# EAGLE design 1x16 to 1x16 (EAGLE 6.4)
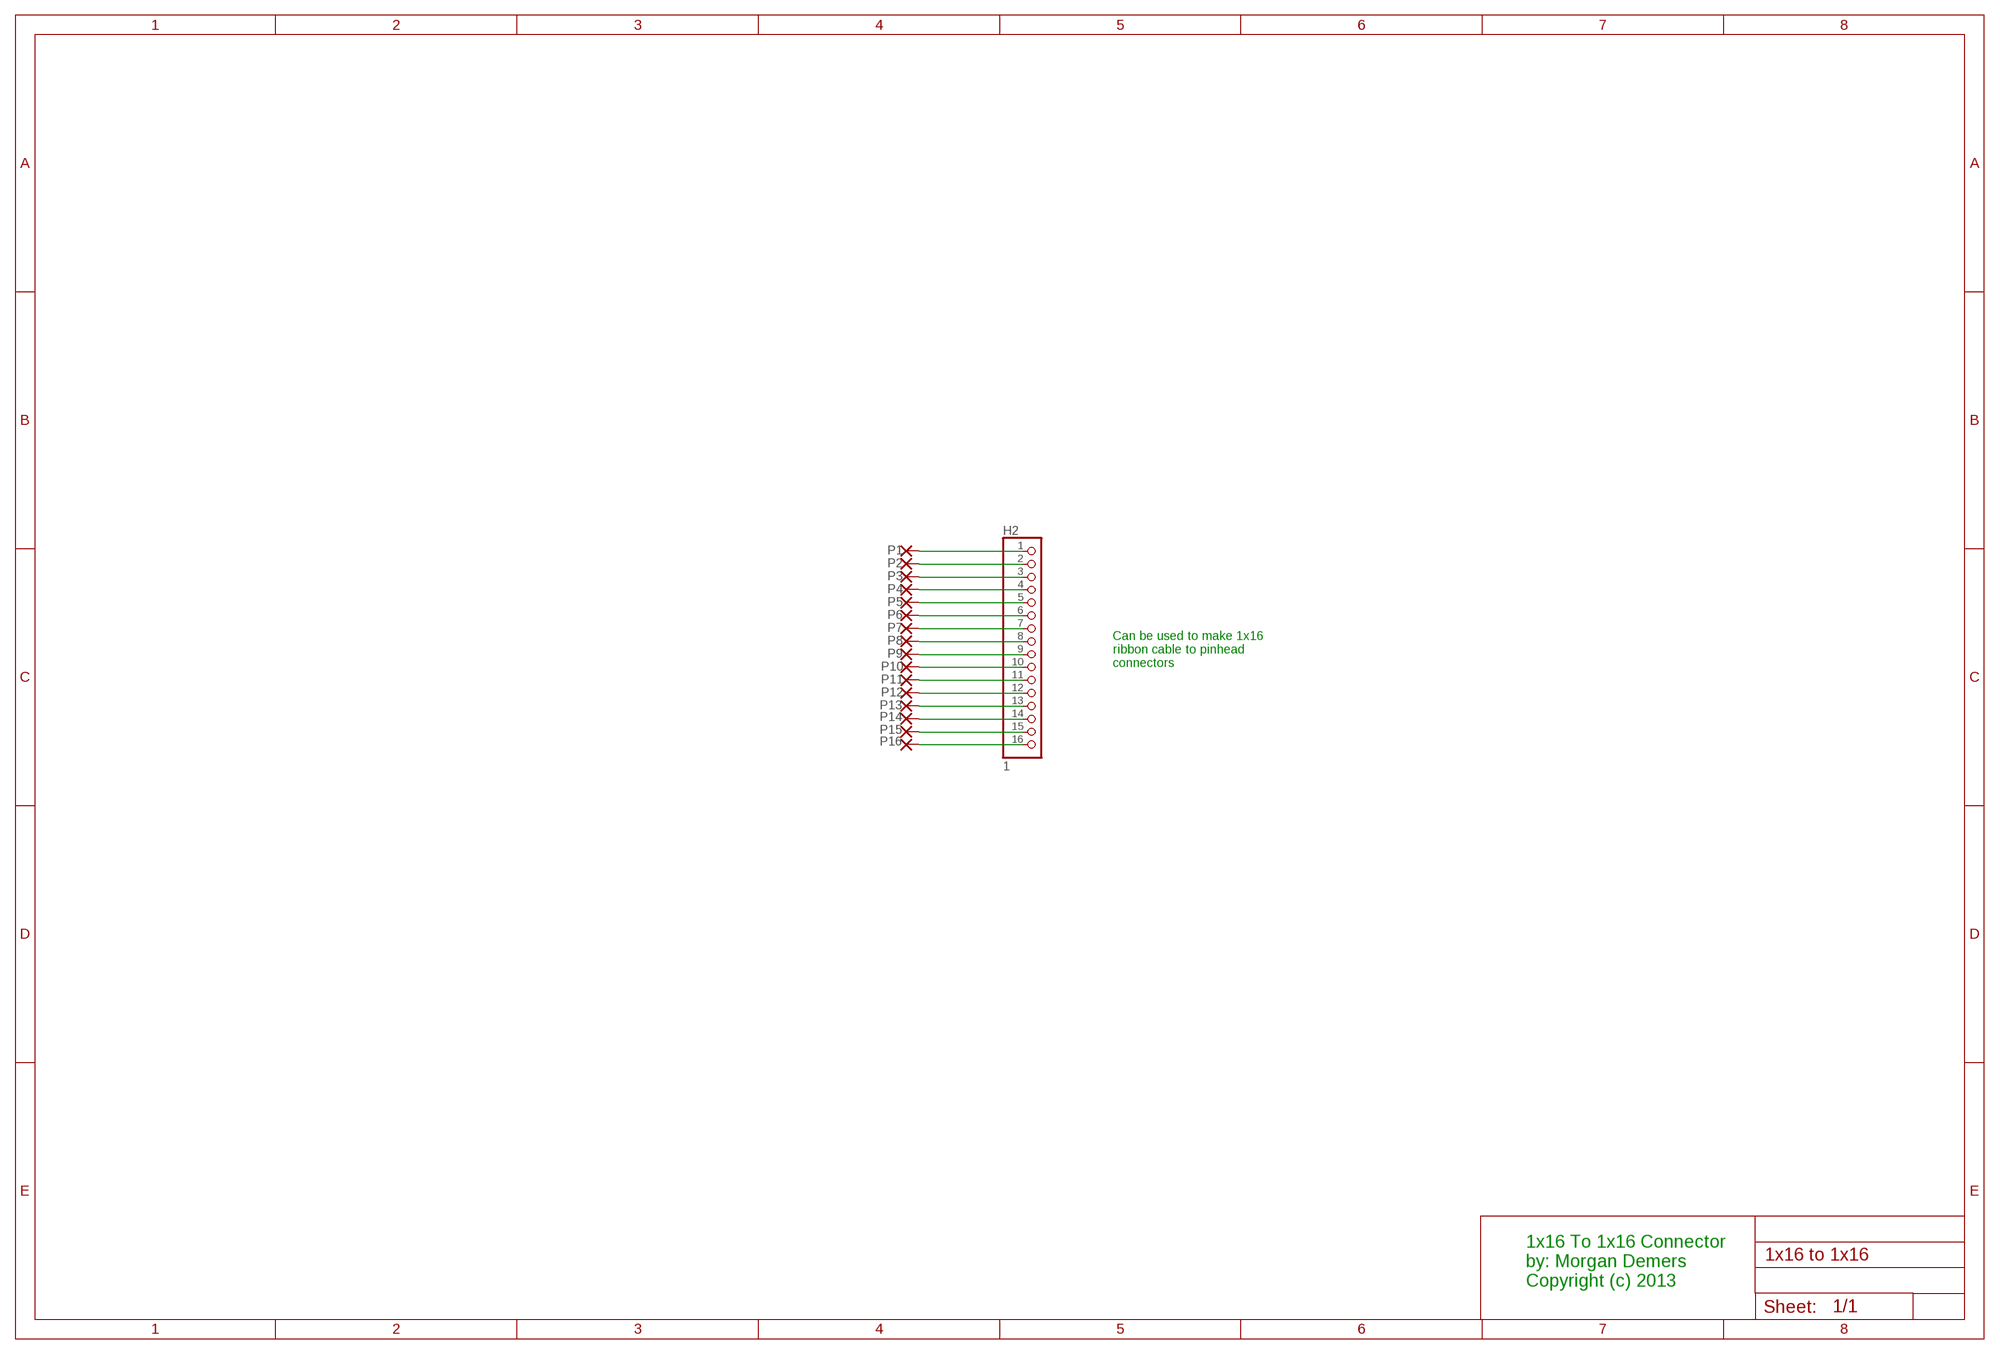
[diagram p0: schematic, sheet 1]

## Parts
H2  1  PINHD-1X16  [1X16]
P1  1,6/0,9  [1,6/0,9]
P2  1,6/0,9  [1,6/0,9]
P3  1,6/0,9  [1,6/0,9]
P4  1,6/0,9  [1,6/0,9]
P5  1,6/0,9  [1,6/0,9]
P6  1,6/0,9  [1,6/0,9]
P7  1,6/0,9  [1,6/0,9]
P8  1,6/0,9  [1,6/0,9]
P9  1,6/0,9  [1,6/0,9]
P10  1,6/0,9  [1,6/0,9]
P11  1,6/0,9  [1,6/0,9]
P12  1,6/0,9  [1,6/0,9]
P13  1,6/0,9  [1,6/0,9]
P14  1,6/0,9  [1,6/0,9]
P15  1,6/0,9  [1,6/0,9]
P16  1,6/0,9  [1,6/0,9]

## Nets
S$1: H2.1 P1.1(P)
S$2: H2.2 P2.1(P)
S$3: H2.3 P3.1(P)
S$4: H2.4 P4.1(P)
S$5: H2.5 P5.1(P)
S$6: H2.6 P6.1(P)
S$7: H2.7 P7.1(P)
S$8: H2.8 P8.1(P)
S$9: H2.9 P9.1(P)
S$10: H2.10 P10.1(P)
S$11: H2.11 P11.1(P)
S$12: H2.12 P12.1(P)
S$13: H2.13 P13.1(P)
S$14: H2.14 P14.1(P)
S$15: H2.15 P15.1(P)
S$16: H2.16 P16.1(P)

## Notes on the sheet
- Can be used to make 1x16
  ribbon cable to pinhead
  connectors
- 1x16 To 1x16 Connector
  by: Morgan Demers
  Copyright (c) 2013

## Library data of the parts
H2 = pinhead:PINHD-1X16: PIN HEADER
P1-P16 = wirepad:1,6/0,9: THROUGH-HOLE PAD

## Board
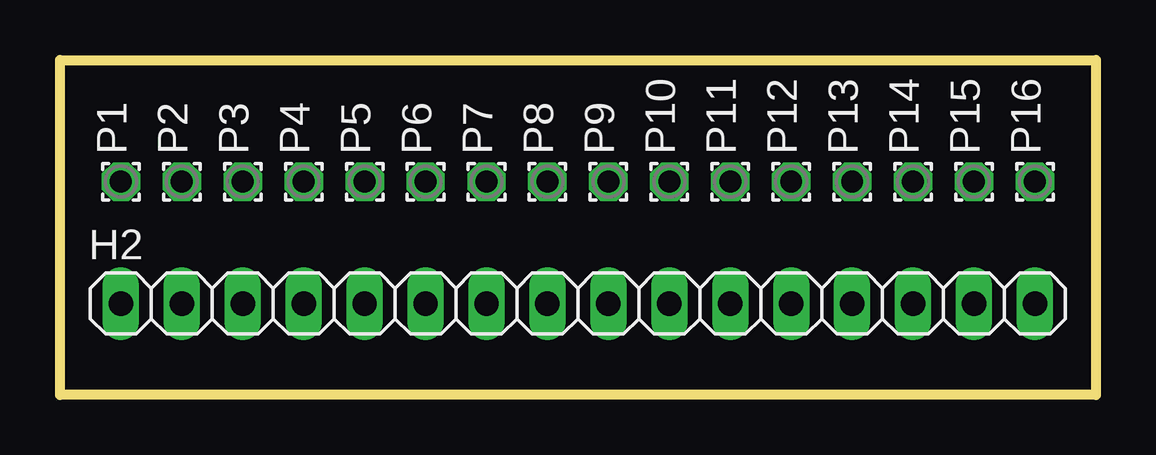
[diagram p1: board, top side]
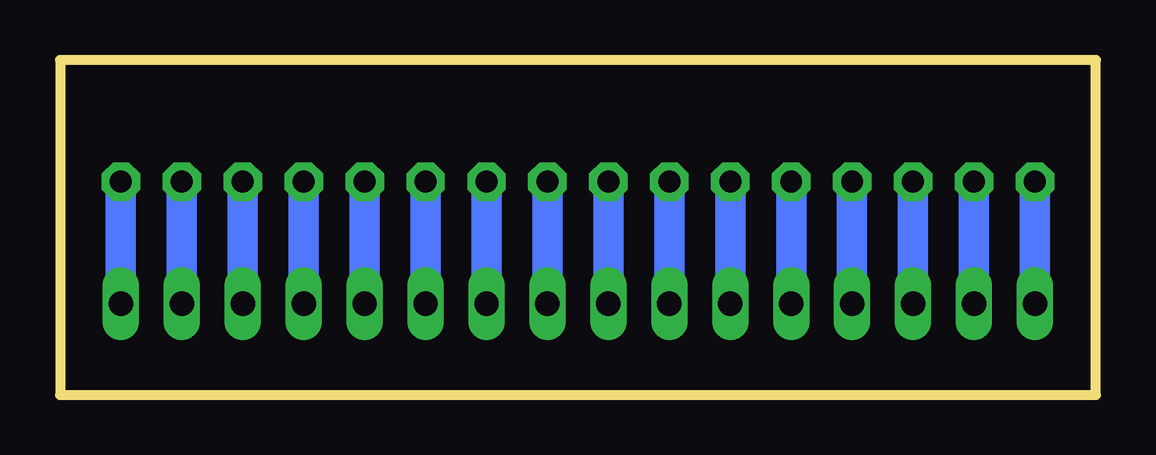
[diagram p2: board, bottom side, seen from below]

Size 43.18 x 13.97 mm. Coordinates in mm from the lower left corner, seen from the top.
Outline: 0,0 0,13.97 43.18,13.97 43.18,0 0,0
Copper layers (1*16): Top 0.035mm / dielectric 1.5mm / Bottom 0.035mm
Design rules "default": minimum track width 10mil, minimum drill 24mil, track to track 8mil, track to pad 8mil, pad to pad 8mil, via to via 8mil, smd to smd 8mil, copper to edge 40mil, drill to drill 8mil, minimum pad ring 10mil, minimum via ring 8mil, stop-mask expansion 4mil, vias tented up to drill 0mil, thermal gap 10mil

### Footprints (pad centres in the part's own frame; a part is rotated, then mirrored left to right if it is on the bottom)
1X16 = drill 1.016 long: 1 -19.05,0; 2 -16.51,0; 3 -13.97,0; 4 -11.43,0; 5 -8.89,0; 6 -6.35,0; 7 -3.81,0; 8 -1.27,0; 9 1.27,0; 10 3.81,0; 11 6.35,0; 12 8.89,0; 13 11.43,0; 14 13.97,0; 15 16.51,0; 16 19.05,0
1,6/0,9 = drill 0.914 pad 1.6 octagon: 1 0,0

### Placement (x,y rotation side)
H2  21.59,3.81 0 top
P1  2.54,8.89 0 top
P2  5.08,8.89 0 top
P3  7.62,8.89 0 top
P4  10.16,8.89 0 top
P5  12.7,8.89 0 top
P6  15.24,8.89 0 top
P7  17.78,8.89 0 top
P8  20.32,8.89 0 top
P9  22.86,8.89 0 top
P10  25.4,8.89 0 top
P11  27.94,8.89 0 top
P12  30.48,8.89 0 top
P13  33.02,8.89 0 top
P14  35.56,8.89 0 top
P15  38.1,8.89 0 top
P16  40.64,8.89 0 top

### Tracks (layer width: path | path; a pad name or v marks a point on that pad's centre or on a via)
S$1
  Bottom 1.27: P1.1 H2.1
S$2
  Bottom 1.27: P2.1 H2.2
S$3
  Bottom 1.27: P3.1 H2.3
S$4
  Bottom 1.27: P4.1 H2.4
S$5
  Bottom 1.27: P5.1 H2.5
S$6
  Bottom 1.27: P6.1 H2.6
S$7
  Bottom 1.27: P7.1 H2.7
S$8
  Bottom 1.27: P8.1 H2.8
S$9
  Bottom 1.27: P9.1 H2.9
S$10
  Bottom 1.27: P10.1 H2.10
S$11
  Bottom 1.27: P11.1 H2.11
S$12
  Bottom 1.27: P12.1 H2.12
S$13
  Bottom 1.27: P13.1 H2.13
S$14
  Bottom 1.27: P14.1 H2.14
S$15
  Bottom 1.27: P15.1 H2.15
S$16
  Bottom 1.27: P16.1 H2.16

### Text on the board
tDocu: 1x16 ribbon to 1x16 header | by Morgan Demers | 16